# EAGLE board DAC (EAGLE 9.5.1), part 1 of 2
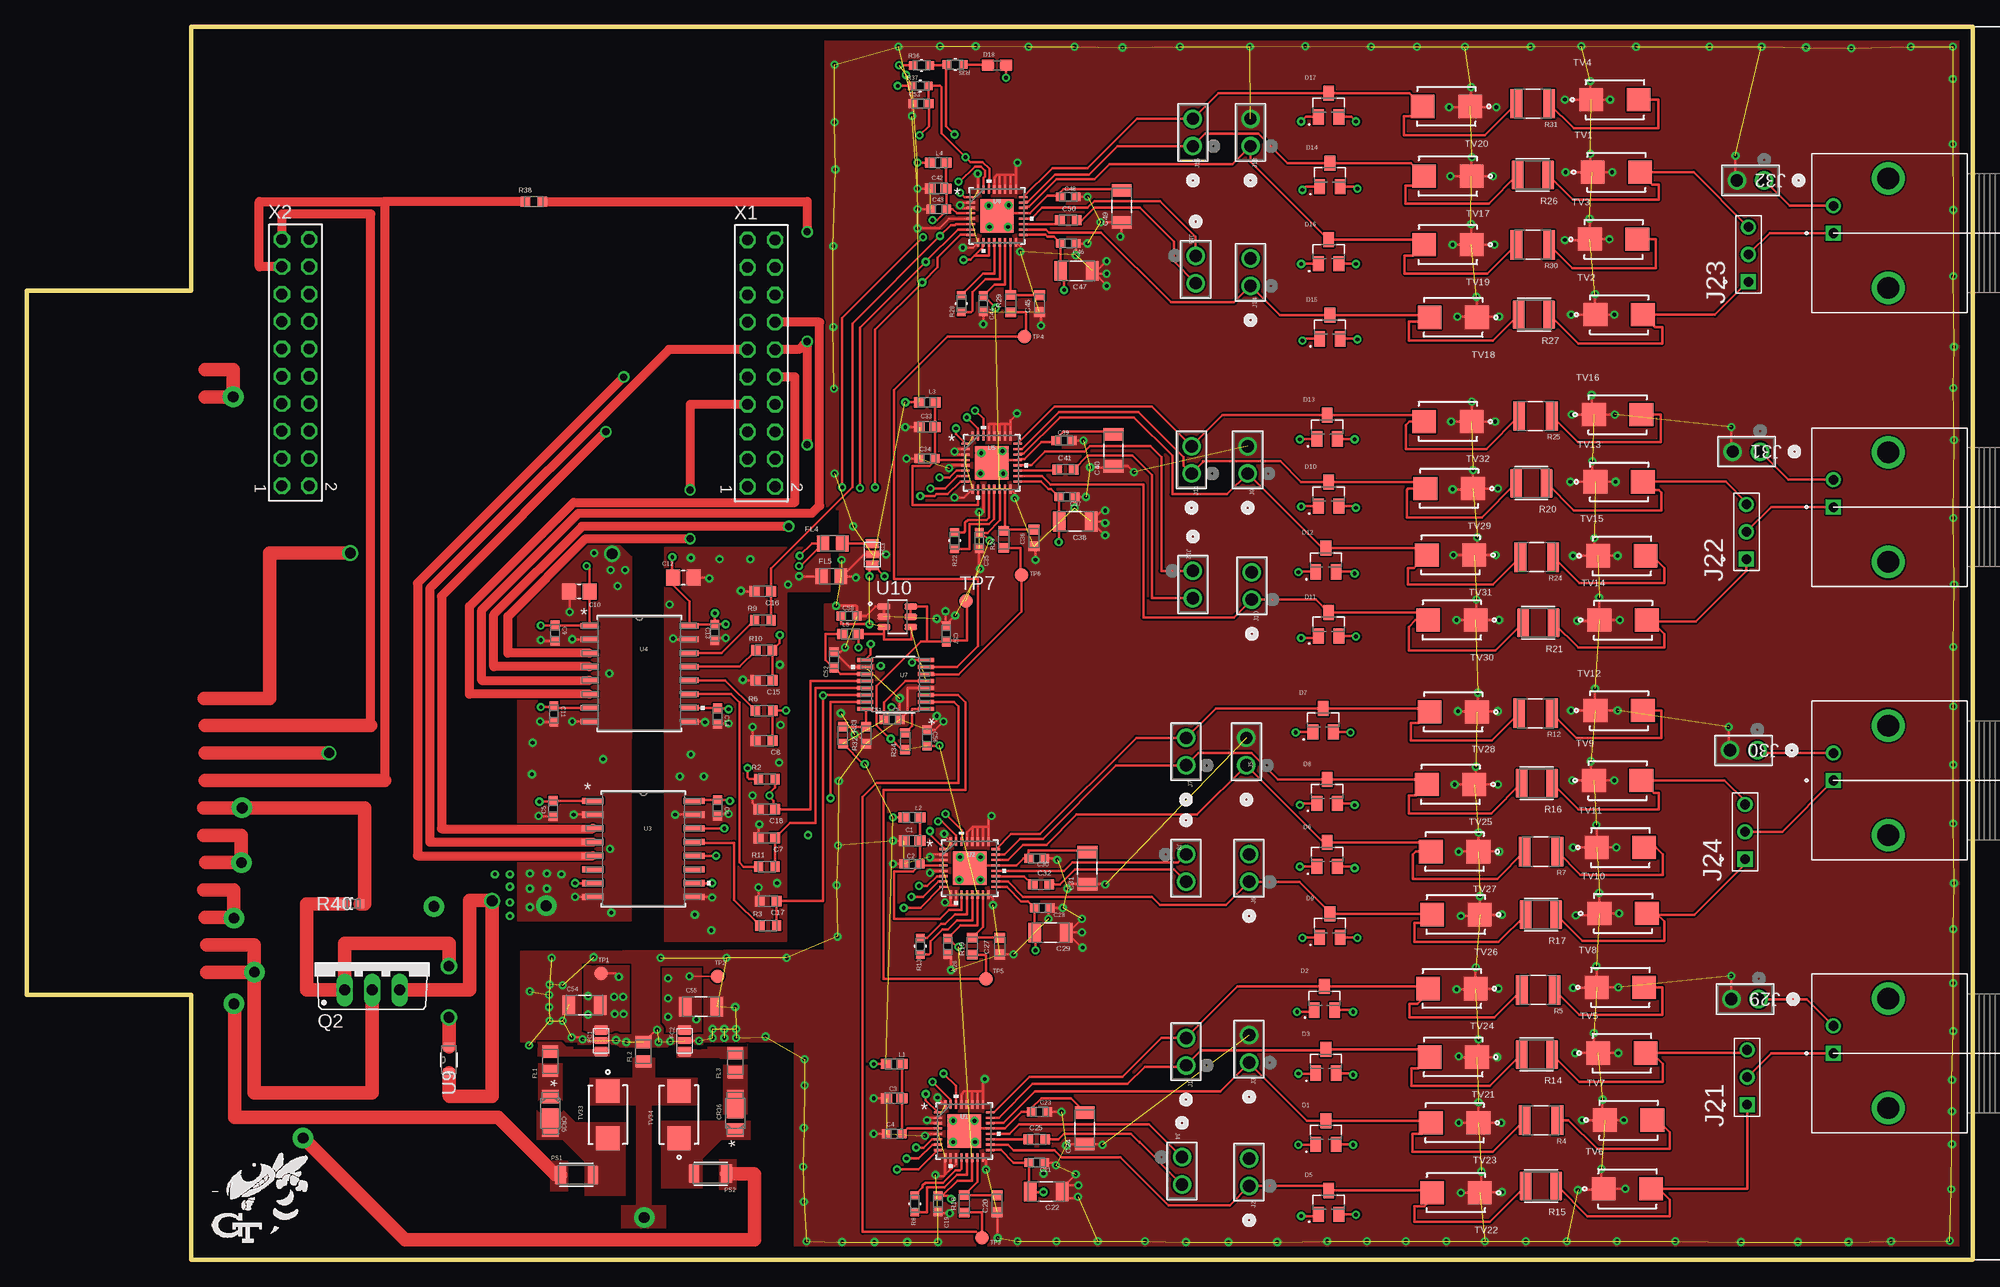
[diagram p5: board, top side]
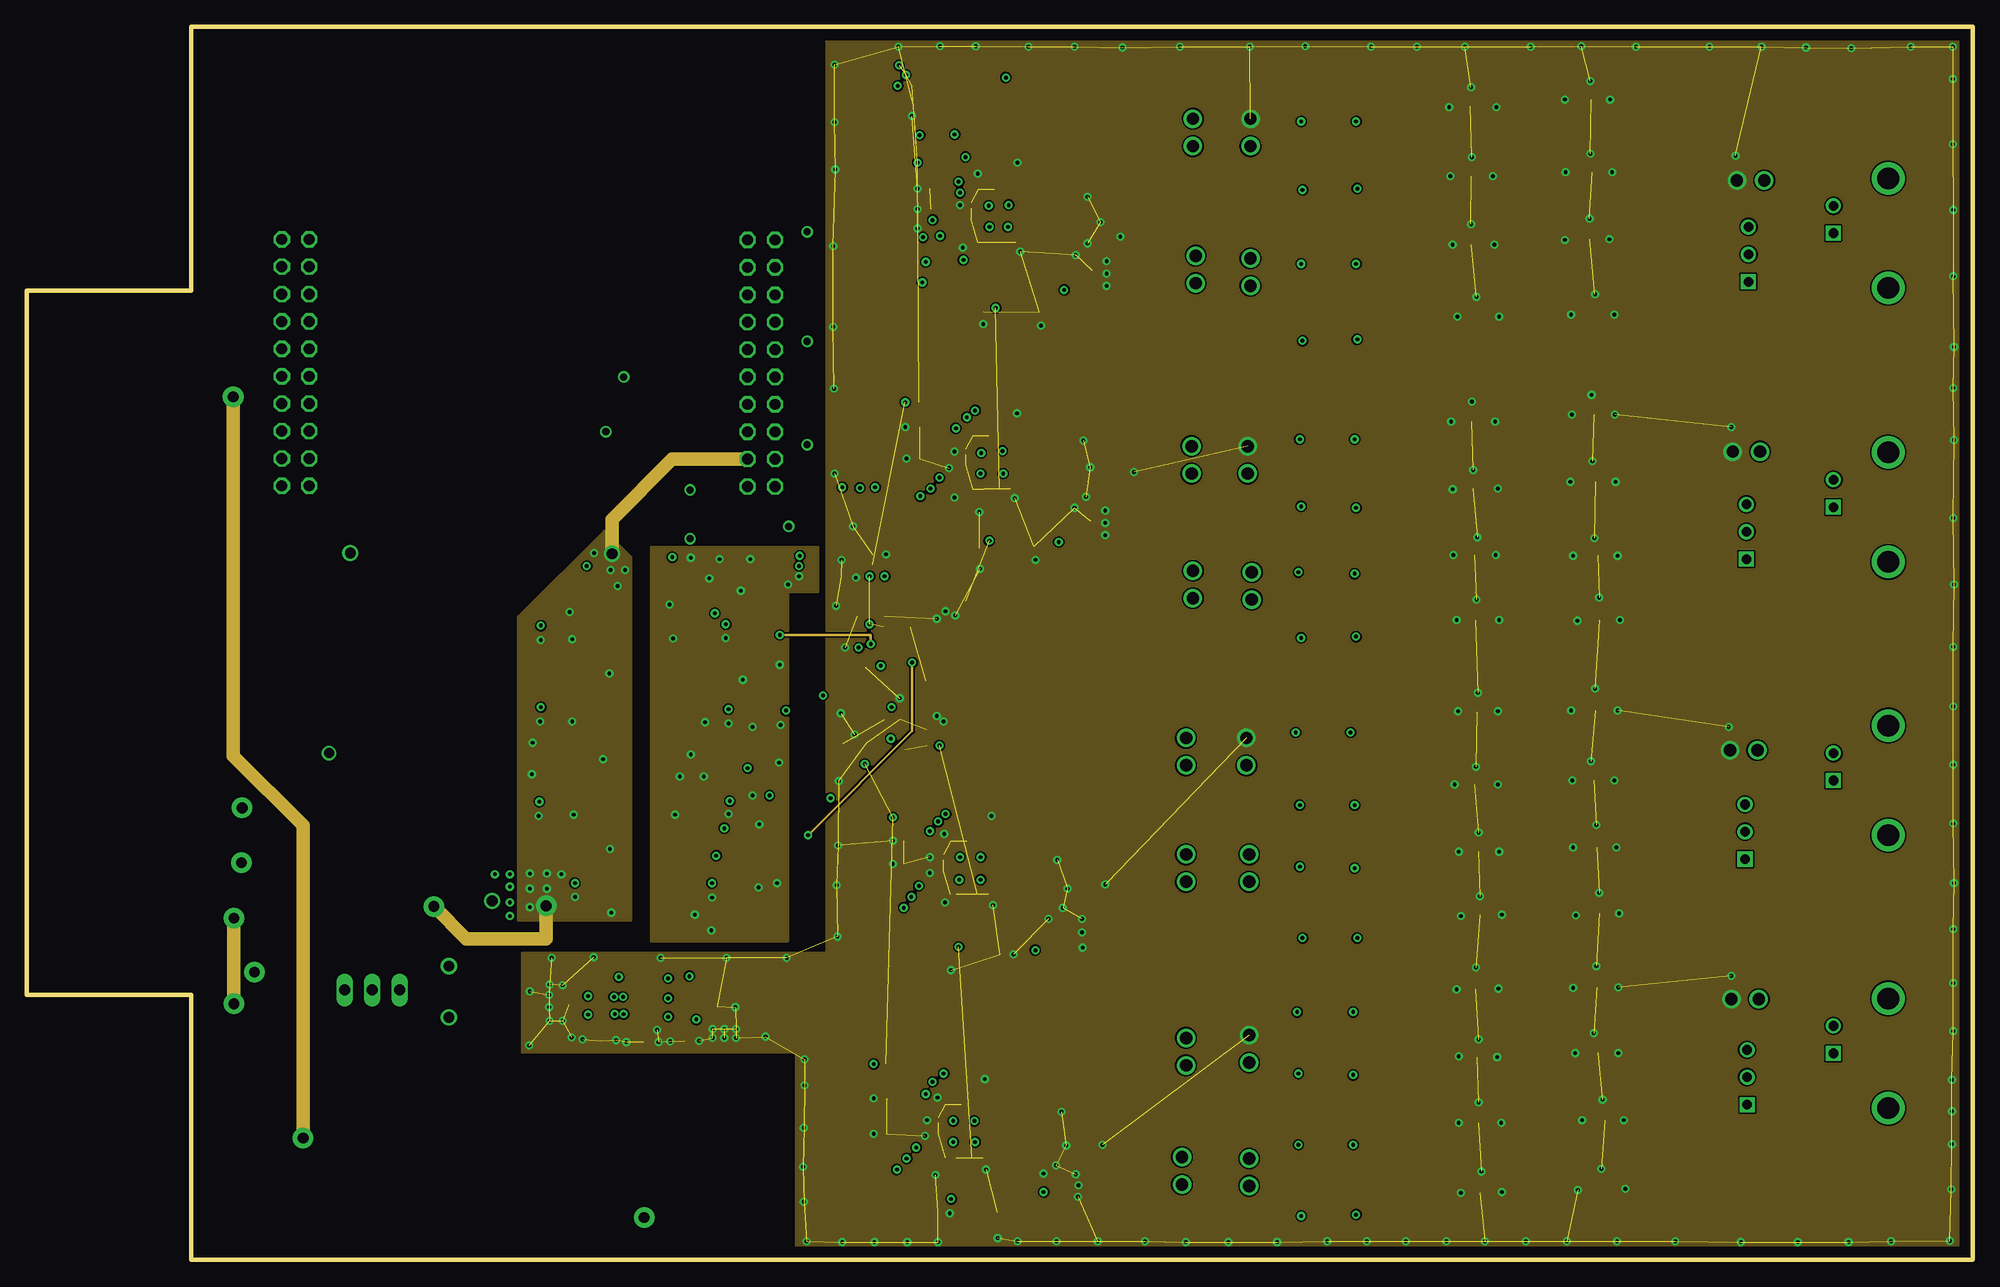
[diagram p6: board, inner layer Route2]
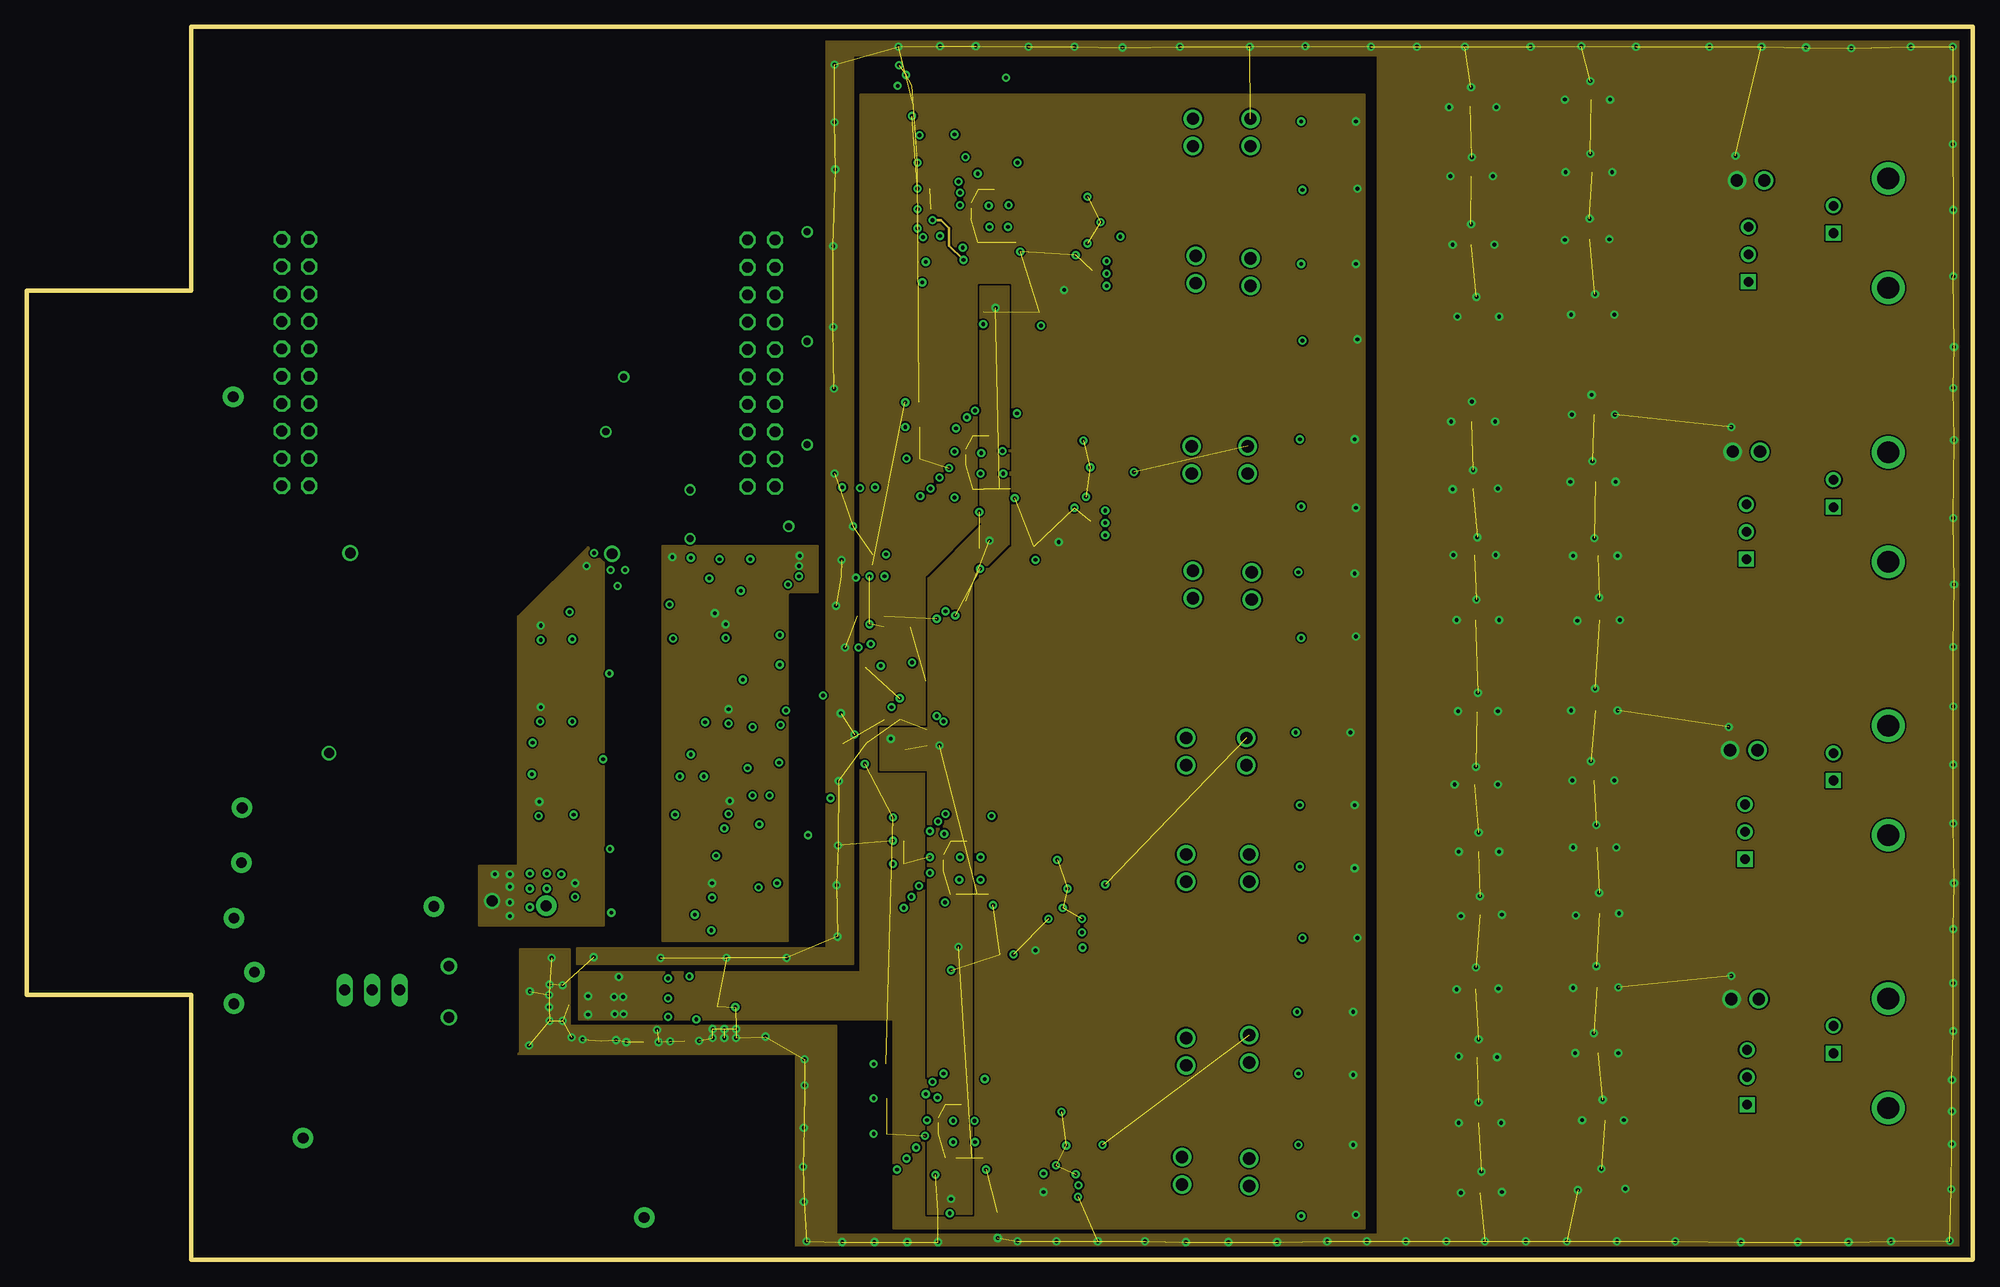
[diagram p7: board, inner layer Route15]
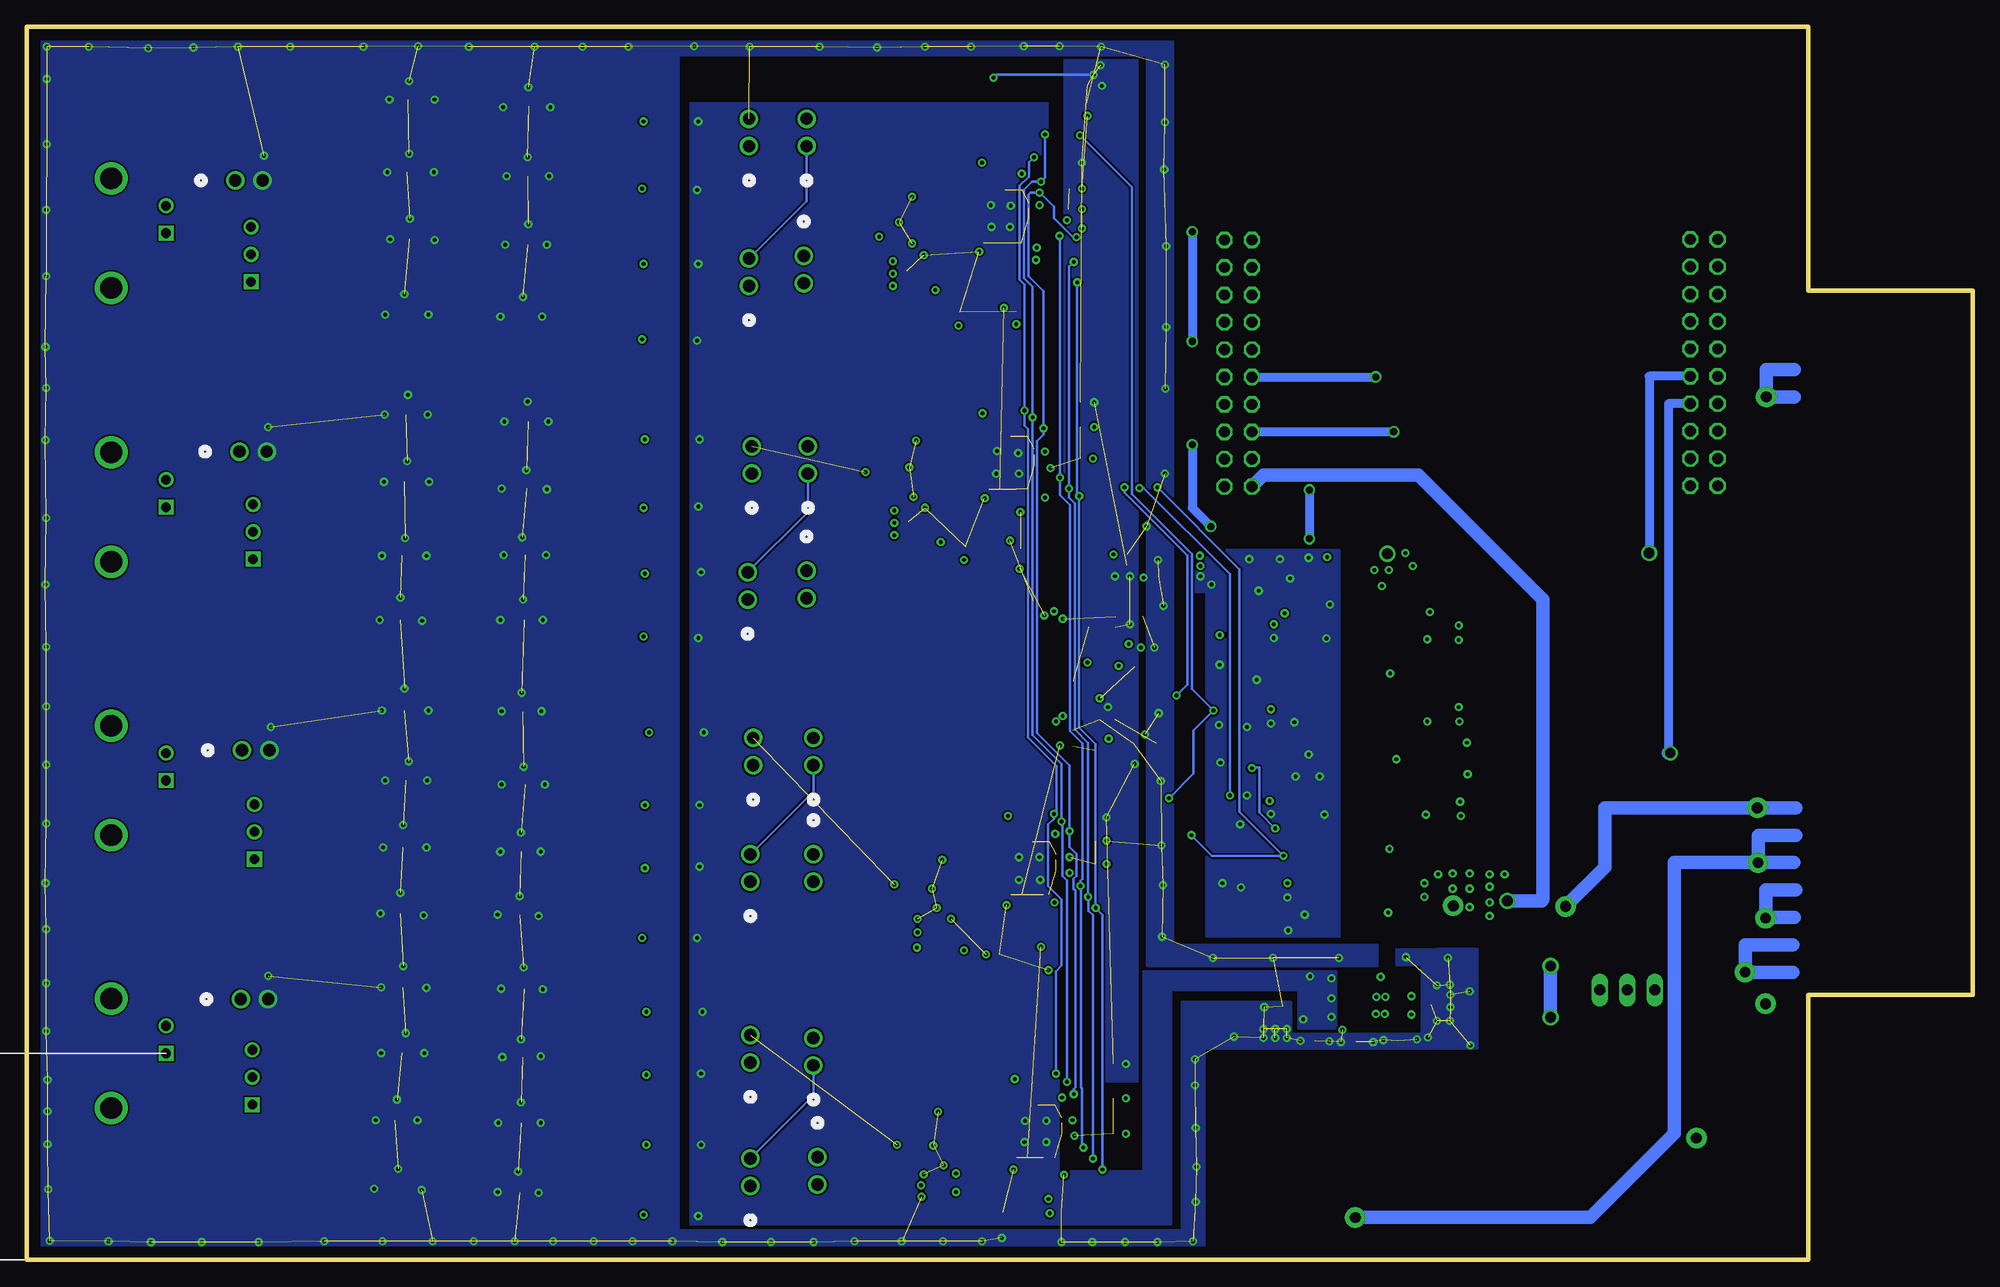
[diagram p8: board, bottom side, seen from below]

Size 180.34 x 114.3 mm. Coordinates in mm from the lower left corner, seen from the top.
Outline: 180.34,0 180.34,114.3 15.24,114.3 15.24,89.85 0,89.85 0,24.57 15.24,24.57 15.24,0 180.34,0
Copper layers ([2:[15:1+2*15+16]]): Top 0.01778125mm / dielectric 12mil / Route2 0.01778125mm / dielectric 39mil / Route15 0.01778125mm / dielectric 12mil / Bottom 0.01778125mm
Design rules "default *": minimum track width 6mil, minimum drill 0.35mm, track to track 6mil, track to pad 6mil, pad to pad 6mil, via to via 6mil, smd to smd 6mil, copper to edge 40mil, drill to drill 6mil, minimum pad ring 10mil, minimum via ring 8mil, stop-mask expansion 4mil, vias tented up to drill 0mil, thermal gap 10mil

## Footprints (pad centres in the part's own frame; a part is rotated, then mirrored left to right if it is on the bottom)
CAPC17595_90N_KEM = smd 1.006 x 0.95: 1 -0.728,0; 2 0.728,0
G-188_MUR = smd 0.864 x 0.813: 1 -0.724,0; 2 0.724,0
CAPC1608X90N = smd 0.92 x 0.98: 1 -0.775,0; 2 0.775,0
CAPC2012X135N = smd 1.3 x 1.5: 1 -0.95,0; 2 0.95,0
CAPC3216X180N = smd 1.16 x 1.82: 1 -1.475,0; 2 1.475,0
CAPC1608X90N' = smd 0.89 x 0.93: 1 -0.77,0; 2 0.77,0
DIODE_SBR3M30P1_1P78X2P8_DIO = smd 1.245 x 1.499: 1 -1.537,0 | smd 2.616 x 1.499: 2 0.851,0
SOT95P240X110-3N = smd 1 x 1.4: 1 -0.95,-1.1; 2 0.95,-1.1; 3 0,1.1
0603 = smd 1.1 x 1: 1 -0.85,0; 2 0.85,0
FCAP = smd 0.647 x 1.25: GND1 0,0 | smd 0.856 x 1.25: IN -1.001,0 | smd 0.855 x 1.25: OUT 1.001,0
BEADC2012X105N = smd 1.14 x 1.47: 1 -0.89,0; 2 0.89,0
CONN_61300211121_WRE = drill 1.143 pad 1.651: 1 0,0; 2 2.54,0
CONN_1-1337543-0 = drill 0.89 square: 1 0,0 | drill 0.89: 2 0,-2.54 | drill 2.01: P1 -5.08,-5.08; P2 -5.08,5.08
TE_5-146274-3 = drill 0.89 square: 1 -2.54,0 | drill 0.89: 2 0,0; 3 2.54,0
IND_BLM18_0603_MUR = smd 0.965 x 0.94: 1 -0.749,0; 2 0.749,0
RESC3115X65N = smd 1.09 x 1.77: 1 -1.465,0 | smd 0.94 x 1.77: 2 1.54,0
TO220BV = drill 1.016 long: D 0,-2.54; G -2.54,-2.54; S 2.54,-2.54
RESC1508X50N = smd 0.86 x 0.98: 1 -0.765,0; 2 0.765,0
RESC3225X60N = smd 1.09 x 2.72: 1 -1.515,0; 2 1.515,0
RESC1608X55N = smd 0.87 x 0.98: 1 -0.8,0; 2 0.8,0
RC0603N_PAN = smd 0.756 x 0.8: 1 -0.778,0; 2 0.778,0
RESC3125X65N = smd 1.1 x 2.67: 1 -1.415,0; 2 1.415,0
RESC1608X55N' = smd 0.87 x 0.93: 1 -0.78,0; 2 0.78,0
B1,27 = smd 1.27 x 1.27: TP 0,0
DIOM5436X220N = smd 2.2 x 2.15: A 2.2,0; C -2.2,0
CP_32_7_ADI = smd 0.755 x 0.199: 1 -2.427,1.75; 2 -2.427,1.25; 3 -2.427,0.75; 4 -2.427,0.25; 5 -2.427,-0.25; 6 -2.427,-0.75; 7 -2.427,-1.25; 8 -2.427,-1.75; 17 2.427,-1.75; 18 2.427,-1.25; 19 2.427,-0.75; 20 2.427,-0.25; 21 2.427,0.25; 22 2.427,0.75; 23 2.427,1.25; 24 2.427,1.75 | smd 0.199 x 0.805: 9 -1.75,-2.452; 10 -1.25,-2.452; 11 -0.75,-2.452; 12 -0.25,-2.452; 13 0.25,-2.452; 14 0.75,-2.452; 15 1.25,-2.452; 16 1.75,-2.452; 25 1.75,2.452; 26 1.25,2.452; 27 0.75,2.452; 28 0.25,2.452; 29 -0.25,2.452; 30 -0.75,2.452; 31 -1.25,2.452; 32 -1.75,2.452 | smd 3.1 x 3.1: 33 0,0
RW_16_ADI = smd 1.981 x 0.559: 1 -4.686,4.445; 2 -4.686,3.175; 3 -4.686,1.905; 4 -4.686,0.635; 5 -4.686,-0.635; 6 -4.686,-1.905; 7 -4.686,-3.175; 8 -4.686,-4.445; 9 4.686,-4.445; 10 4.686,-3.175; 11 4.686,-1.905; 12 4.686,-0.635; 13 4.686,0.635; 14 4.686,1.905; 15 4.686,3.175; 16 4.686,4.445
RW_16_ADI-L = smd 1.676 x 0.508: 1 -4.636,4.445; 2 -4.636,3.175; 3 -4.636,1.905; 4 -4.636,0.635; 5 -4.636,-0.635; 6 -4.636,-1.905; 7 -4.636,-3.175; 8 -4.636,-4.445; 9 4.636,-4.445; 10 4.636,-3.175; 11 4.636,-1.905; 12 4.636,-0.635; 13 4.636,0.635; 14 4.636,1.905; 15 4.636,3.175; 16 4.636,4.445
RU-16_ADI = smd 1.461 x 0.351: 1 -2.825,2.275; 2 -2.825,1.625; 3 -2.825,0.975; 4 -2.825,0.325; 5 -2.825,-0.325; 6 -2.825,-0.975; 7 -2.825,-1.625; 8 -2.825,-2.275; 9 2.825,-2.275; 10 2.825,-1.625; 11 2.825,-0.975; 12 2.825,-0.325; 13 2.825,0.325; 14 2.825,0.975; 15 2.825,1.625; 16 2.825,2.275
CZRF = smd 0.813 x 0.965: 1 -1.194,0; 2 1.194,0
SOT95P280X145-6N = smd 1.22 x 0.6: 1 -1.245,0.95; 2 -1.245,0; 3 -1.245,-0.95; 4 1.245,-0.95; 5 1.245,0; 6 1.245,0.95
TSW-110-XX-G-D = drill 1 pad 1.5 octagon: 1 11.43,-1.27; 2 11.43,1.27; 3 8.89,-1.27; 4 8.89,1.27; 5 6.35,-1.27; 6 6.35,1.27; 7 3.81,-1.27; 8 3.81,1.27; 9 1.27,-1.27; 10 1.27,1.27; 11 -1.27,-1.27; 12 -1.27,1.27; 13 -3.81,-1.27; 14 -3.81,1.27; 15 -6.35,-1.27; 16 -6.35,1.27; 17 -8.89,-1.27; 18 -8.89,1.27; 19 -11.43,-1.27; 20 -11.43,1.27

## Placement (x,y rotation side)
C1  1muF 10V 0603  [CAPC17595_90N_KEM]  82.04,38.86 0 top
C2  0.1muF  [G-188_MUR]  82.04,36.7 0 top
C3  1muF 10V 0603  [CAPC17595_90N_KEM]  80.39,14.99 0 top
C4  0.1muF  [G-188_MUR]  80.39,11.68 0 top
C5  0.1muF  [G-188_MUR]  48.77,41.85 90 top
C6  0.1muF  [G-188_MUR]  64.01,41.91 270 top
C7  100pF 50V 0603  [CAPC1608X90N]  68.58,39.12 180 top
C8  100pF 50V 0603  [CAPC1608X90N]  68.33,48.13 180 top
C9  0.1muF  [G-188_MUR]  48.96,58.1 270 top
C10  10muF  [CAPC2012X135N]  51.18,61.98 180 top
C11  0.1muF  [G-188_MUR]  48.83,50.61 270 top
C12  10muF  [CAPC2012X135N]  60.83,63.25 0 top
C13  0.1muF  [G-188_MUR]  63.75,58.17 270 top
C14  0.1muF  [G-188_MUR]  64.01,50.42 270 top
C15  100pF 50V 0603  [CAPC1608X90N]  68.33,53.72 180 top
C16  100pF 50V 0603  [CAPC1608X90N]  68.2,61.98 180 top
C17  100pF 50V 0603  [CAPC1608X90N]  68.71,33.27 180 top
C18  100pF 50V 0603  [CAPC1608X90N]  68.58,41.78 180 top
C19  0.1muF  [G-188_MUR]  84.45,5.21 90 top
C20  100pF 50V 0603  [CAPC1608X90N]  89.92,5.21 90 top
C21  0.1muF  [G-188_MUR]  93.6,9.02 180 top
C22  10muF 25V 1206  [CAPC3216X180N]  94.49,6.35 180 top
C23  0.1muF  [G-188_MUR]  93.85,13.72 180 top
C24  10muF 25V 1206  [CAPC3216X180N]  98.04,12.19 90 top
C25  1nF 50V 0603  [CAPC1608X90N']  93.6,11.18 0 top
C26  0.1muF  [G-188_MUR]  85.34,29.08 90 top
C27  100pF 50V 0603  [CAPC1608X90N]  90.17,29.08 90 top
C28  0.1muF  [G-188_MUR]  94.11,32.64 180 top
C29  10muF 25V 1206  [CAPC3216X180N]  94.87,30.35 180 top
C30  0.1muF  [G-188_MUR]  93.6,37.21 180 top
C31  10muF 25V 1206  [CAPC3216X180N]  98.3,36.32 90 top
C32  1nF 50V 0603  [CAPC1608X90N']  93.98,34.8 0 top
C33  1muF 10V 0603  [CAPC17595_90N_KEM]  83.44,77.22 0 top
C34  0.1muF  [G-188_MUR]  83.44,74.3 0 top
C35  0.1muF  [G-188_MUR]  88.27,66.67 90 top
C36  100pF 50V 0603  [CAPC1608X90N]  93.34,66.93 90 top
C37  0.1muF  [G-188_MUR]  96.39,70.74 180 top
C38  10muF 25V 1206  [CAPC3216X180N]  97.16,68.45 180 top
C39  0.1muF  [G-188_MUR]  96.14,75.95 180 top
C40  10muF 25V 1206  [CAPC3216X180N]  100.71,75.06 90 top
C41  1nF 50V 0603  [CAPC1608X90N']  96.27,73.28 0 top
C42  1muF 10V 0603  [CAPC17595_90N_KEM]  84.45,99.31 0 top
C43  0.1muF  [G-188_MUR]  84.52,97.41 0 top
C44  0.1muF  [G-188_MUR]  88.65,88.65 90 top
C45  100pF 50V 0603  [CAPC1608X90N]  93.85,88.65 90 top
C46  0.1muF  [G-188_MUR]  96.52,94.23 180 top
C47  10muF 25V 1206  [CAPC3216X180N]  97.28,91.69 180 top
C48  0.1muF  [G-188_MUR]  96.52,98.55 180 top
C49  10muF 25V 1206  [CAPC3216X180N]  101.47,97.66 90 top
C50  1nF 50V 0603  [CAPC1608X90N']  96.52,96.39 0 top
C51  0.1muF  [G-188_MUR]  80.2,50.1 0 top
C52  0.1muF  [G-188_MUR]  74.8,55.63 90 top
C53  0.1muF  [G-188_MUR]  82.87,107.19 0 top
C54  10muF 25V 1206  [CAPC3216X180N]  51.69,23.62 0 top
C55  10muF 25V 1206  [CAPC3216X180N]  62.48,23.5 0 top
C56  0.1muF  [G-188_MUR]  83.44,48.39 270 top
C57  0.1muF  [G-188_MUR]  85.22,58.04 270 top
C58  0.1muF  [G-188_MUR]  76.2,59.69 180 top
CR35  SBR2U30P1-7  [DIODE_SBR3M30P1_1P78X2P8_DIO]  48.51,13.59 270 top
CR36  SBR2U30P1-7  [DIODE_SBR3M30P1_1P78X2P8_DIO]  65.66,13.59 90 top
D1  BAT54S-7-F  [SOT95P240X110-3N]  120.4,11.81 0 top
D2  BAT54S-7-F  [SOT95P240X110-3N]  120.27,24.26 0 top
D3  BAT54S-7-F  [SOT95P240X110-3N]  120.4,18.41 0 top
D5  BAT54S-7-F  [SOT95P240X110-3N]  120.65,5.33 0 top
D6  BAT54S-7-F  [SOT95P240X110-3N]  120.52,37.59 0 top
D7  BAT54S-7-F  [SOT95P240X110-3N]  120.14,50.04 0 top
D8  BAT54S-7-F  [SOT95P240X110-3N]  120.52,43.43 0 top
D9  BAT54S-7-F  [SOT95P240X110-3N]  120.78,30.99 0 top
D10  BAT54S-7-F  [SOT95P240X110-3N]  120.65,70.99 0 top
D11  BAT54S-7-F  [SOT95P240X110-3N]  120.65,58.93 0 top
D12  BAT54S-7-F  [SOT95P240X110-3N]  120.4,64.9 0 top
D13  BAT54S-7-F  [SOT95P240X110-3N]  120.52,77.22 0 top
D14  BAT54S-7-F  [SOT95P240X110-3N]  120.78,100.58 0 top
D15  BAT54S-7-F  [SOT95P240X110-3N]  120.78,86.49 0 top
D16  BAT54S-7-F  [SOT95P240X110-3N]  120.65,93.47 0 top
D17  BAT54S-7-F  [SOT95P240X110-3N]  120.65,107.06 0 top
D18  LTST-C191KFKT  [0603]  89.92,110.74 0 top
FC1  F1-4  [FCAP]  53.21,20.32 90 top
FC2  F1-4  [FCAP]  60.96,20.32 90 top
FC3  F1-4  [FCAP]  78.36,65.41 270 top
FL1  330@100MHz  [BEADC2012X105N]  48.51,18.41 90 top
FL2  330@100MHz  [BEADC2012X105N]  57.15,19.3 90 top
FL3  330@100MHz  [BEADC2012X105N]  65.66,18.29 90 top
FL4  330@100MHz  [BEADC2012X105N]  74.68,66.42 0 top
FL5  330@100MHz  [BEADC2012X105N]  74.55,63.37 0 top
J1  61300211121  [CONN_61300211121_WRE]  107.44,18.03 90 top
J2  61300211121  [CONN_61300211121_WRE]  113.28,6.86 90 top
J3  61300211121  [CONN_61300211121_WRE]  113.28,18.29 90 top
J4  61300211121  [CONN_61300211121_WRE]  107.06,9.53 270 top
J5  61300211121  [CONN_61300211121_WRE]  113.03,45.85 90 top
J6  61300211121  [CONN_61300211121_WRE]  113.28,35.05 90 top
J7  61300211121  [CONN_61300211121_WRE]  107.44,45.85 90 top
J8  61300211121  [CONN_61300211121_WRE]  107.44,37.59 270 top
J9  61300211121  [CONN_61300211121_WRE]  113.16,72.9 90 top
J10  61300211121  [CONN_61300211121_WRE]  113.54,61.21 90 top
J11  61300211121  [CONN_61300211121_WRE]  107.95,72.9 90 top
J12  61300211121  [CONN_61300211121_WRE]  108.08,63.88 270 top
J13  61300211121  [CONN_61300211121_WRE]  113.41,103.25 90 top
J14  61300211121  [CONN_61300211121_WRE]  113.41,90.3 90 top
J15  61300211121  [CONN_61300211121_WRE]  108.08,103.25 90 top
J16  61300211121  [CONN_61300211121_WRE]  108.33,93.09 270 top
J17  1-1337543-0  [CONN_1-1337543-0]  167.45,19.15 180 top
J18  1-1337543-0  [CONN_1-1337543-0]  167.45,44.45 180 top
J19  1-1337543-0  [CONN_1-1337543-0]  167.45,69.79 180 top
J20  1-1337543-0  [CONN_1-1337543-0]  167.45,95.19 180 top
J21  5-146274-3  [TE_5-146274-3]  159.45,16.93 90 top
J22  5-146274-3  [TE_5-146274-3]  159.39,67.5 90 top
J23  5-146274-3  [TE_5-146274-3]  159.58,93.22 90 top
J24  5-146274-3  [TE_5-146274-3]  159.26,39.69 90 top
J29  61300211121  [CONN_61300211121_WRE]  160.53,24.17 180 top
J30  61300211121  [CONN_61300211121_WRE]  160.4,47.24 180 top
J31  61300211121  [CONN_61300211121_WRE]  160.66,74.93 180 top
J32  61300211121  [CONN_61300211121_WRE]  161.04,100.08 180 top
L1  1k@100MHz  [IND_BLM18_0603_MUR]  80.39,18.16 180 top
L2  1k@100MHz  [IND_BLM18_0603_MUR]  82.04,41.02 180 top
L3  1k@100MHz  [IND_BLM18_0603_MUR]  83.44,79.5 180 top
L4  1k@100MHz  [IND_BLM18_0603_MUR]  84.45,101.73 180 top
L5  1k@100MHZ  [IND_BLM18_0603_MUR]  76.33,58.04 0 top
PS1  POLYSWITCH  [RESC3115X65N]  50.93,7.87 0 top
PS2  POLYSWITCH  [RESC3115X65N]  63.37,8 180 top
Q2  IRF9530  [TO220BV]  32,27.56 0 top
R2  33ohm 1% 0603  [RESC1508X50N]  68.58,44.58 0 top
R3  33ohm 1% 0603  [RESC1508X50N]  68.71,30.99 0 top
R4  CRCW12101K00FKEA  [RESC3225X60N]  140.34,12.95 180 top
R5  CRCW12101K00FKEA  [RESC3225X60N]  140.08,25.02 180 top
R6  1kohm 5% 0603  [RESC1608X55N]  68.33,50.93 0 top
R7  CRCW12101K00FKEA  [RESC3225X60N]  140.34,37.85 180 top
R8  15kohm 0.1% 0603  [RC0603N_PAN]  82.3,5.21 90 top
R9  33ohm 1% 0603  [RESC1508X50N]  68.2,59.31 0 top
R10  33ohm 1% 0603  [RESC1508X50N]  68.33,56.52 0 top
R11  33ohm 1% 0603  [RESC1508X50N]  68.58,36.45 0 top
R12  CRCW12101K00FKEA  [RESC3225X60N]  139.83,50.67 180 top
R13  15kohm 0.1% 0603  [RC0603N_PAN]  82.8,29.08 90 top
R14  MICROSMD005F-2  [RESC3125X65N]  139.95,19.05 180 top
R15  MICROSMD005F-2  [RESC3125X65N]  140.34,6.86 180 top
R16  MICROSMD005F-2  [RESC3125X65N]  139.95,44.2 180 top
R17  MICROSMD005F-2  [RESC3125X65N]  140.34,32 180 top
R18  160ohm 1% 060  [RESC1608X55N]  86.87,5.21 270 top
R19  160ohm 1% 060  [RESC1608X55N]  87.63,29.08 270 top
R20  MICROSMD005F-2  [RESC3125X65N]  139.45,72.01 180 top
R21  MICROSMD005F-2  [RESC3125X65N]  140.08,59.05 180 top
R22  15kohm 0.1% 0603  [RC0603N_PAN]  85.98,66.67 90 top
R23  160ohm 1% 060  [RESC1608X55N]  90.55,66.8 270 top
R24  CRCW12101K00FKEA  [RESC3225X60N]  139.95,65.15 180 top
R25  CRCW12101K00FKEA  [RESC3225X60N]  139.83,78.23 180 top
R26  MICROSMD005F-2  [RESC3125X65N]  139.57,100.58 180 top
R27  MICROSMD005F-2  [RESC3125X65N]  139.7,87.63 180 top
R28  15kohm 0.1% 0603  [RC0603N_PAN]  86.61,88.65 90 top
R29  160ohm 1% 0603  [RESC1608X55N]  91.19,88.65 270 top
R30  CRCW12101K00FKEA  [RESC3225X60N]  139.57,94.11 180 top
R31  CRCW12101K00FKEA  [RESC3225X60N]  139.57,107.19 180 top
R32  0ohm 0603  [RESC1608X55N']  77.79,48.64 90 top
R33  0ohm 0603  [RESC1608X55N']  75.63,48.64 270 top
R34  0ohm 0603  [RESC1608X55N']  81.41,48.07 90 top
R35  1kohm 5% 0603  [RC0603N_PAN]  86.04,110.81 180 top
R36  10kohm 5% 0603  [RC0603N_PAN]  82.93,110.74 0 top
R37  10kohm 5% 0603  [RC0603N_PAN]  82.8,108.84 0 top
R38  CRCW06030000Z0EBC  [RESC1608X55N']  46.99,98.11 0 top
R40  10kohm 5% 0603  [RC0603N_PAN]  30.1,33.02 0 top
TP1  PTR1B1,27  [B1,27]  53.21,26.54 0 top
TP2  PTR1B1,27  [B1,27]  64.01,26.29 0 top
TP3  PTR1B1,27  [B1,27]  88.52,2.03 0 top
TP4  PTR1B1,27  [B1,27]  92.46,85.6 0 top
TP5  PTR1B1,27  [B1,27]  88.9,26.04 0 top
TP6  PTR1B1,27  [B1,27]  92.2,63.5 0 top
TP7  PTR1B1,27  [B1,27]  87.06,61.09 0 top
TV1  54_SMBJ54CA  [DIOM5436X220N]  147.32,100.84 0 top
TV2  54_SMBJ54CA  [DIOM5436X220N]  147.57,87.63 0 top
TV3  SMBJ54CA  [DIOM5436X220N]  147.07,94.61 0 top
TV4  54_SMBJ54CA  [DIOM5436X220N]  147.19,107.57 0 top
TV5  54_SMBJ54CA  [DIOM5436X220N]  147.83,19.18 0 top
TV6  54_SMBJ54CA  [DIOM5436X220N]  148.34,6.6 0 top
TV7  54_SMBJ54CA  [DIOM5436X220N]  148.46,12.95 0 top
TV8  54_SMBJ54CA  [DIOM5436X220N]  147.7,25.27 0 top
TV9  54_SMBJ54CA  [DIOM5436X220N]  147.45,44.45 0 top
TV10  54_SMBJ54CA  [DIOM5436X220N]  147.96,32.13 0 top
TV11  54_SMBJ54CA  [DIOM5436X220N]  147.7,38.23 0 top
TV12  54_SMBJ54CA  [DIOM5436X220N]  147.57,50.93 0 top
TV13  54_SMBJ54CA  [DIOM5436X220N]  147.57,72.14 0 top
TV14  54_SMBJ54CA  [DIOM5436X220N]  147.96,59.31 0 top
TV15  54_SMBJ54CA  [DIOM5436X220N]  147.83,65.28 0 top
TV16  54_SMBJ54CA  [DIOM5436X220N]  147.45,78.36 0 top
TV17  SMBJ16CA  [DIOM5436X220N]  131.7,100.46 180 top
TV18  SMBJ16CA  [DIOM5436X220N]  132.21,87.38 180 top
TV19  SMBJ16CA  [DIOM5436X220N]  131.7,94.11 180 top
TV20  SMBJ16CA  [DIOM5436X220N]  131.57,106.93 180 top
TV21  SMBJ16CA  [DIOM5436X220N]  132.21,18.8 180 top
TV22  SMBJ16CA  [DIOM5436X220N]  132.46,6.22 180 top
TV23  SMBJ16CA  [DIOM5436X220N]  132.33,12.7 180 top
TV24  SMBJ16CA  [DIOM5436X220N]  132.08,25.15 180 top
TV25  SMBJ16CA  [DIOM5436X220N]  131.95,44.07 180 top
TV26  SMBJ16CA  [DIOM5436X220N]  132.46,32 180 top
TV27  SMBJ16CA  [DIOM5436X220N]  132.33,37.85 180 top
TV28  SMBJ16CA  [DIOM5436X220N]  132.21,50.8 180 top
TV29  SMBJ16CA  [DIOM5436X220N]  131.83,71.5 180 top
TV30  SMBJ16CA  [DIOM5436X220N]  132.08,59.31 180 top
TV31  SMBJ16CA  [DIOM5436X220N]  131.95,65.34 180 top
TV32  SMBJ16CA  [DIOM5436X220N]  131.7,77.72 180 top
TV33  SMBJ16CA  [DIOM5436X220N]  53.85,13.46 270 top
TV34  SMBJ16CA  [DIOM5436X220N]  60.45,13.46 90 top
U1  AD5750-2BCPZ  [CP_32_7_ADI]  86.87,11.94 0 top
U2  AD5750-2BCPZ  [CP_32_7_ADI]  87.38,36.32 0 top
U3  ADUM3301BRWZ  [RW_16_ADI]  57.15,38.1 0 top
U4  ADUM5400ARWZRW_16_ADI-L  [RW_16_ADI-L]  56.77,54.36 0 top
U5  AD5750-2BCPZ  [CP_32_7_ADI]  89.41,73.91 0 top
U6  AD5750-2BCPZ  [CP_32_7_ADI]  89.92,96.77 0 top
U7  AD5686RARUZ  [RU-16_ADI]  80.52,53.34 180 top
U9  CZRF15VB-HF  [CZRF]  39.12,18.54 90 top
U10  MAX6071BAUT25T  [SOT95P280X145-6N]  80.68,59.62 0 top
X1  X1 (J3_J1)  [TSW-110-XX-G-D]  68.07,83.12 270 top
X2  X2 (J2_J4)  [TSW-110-XX-G-D]  24.89,83.19 270 top